# Altium schematic sheet MainBoard_Light.SchDoc: Main Board Light Detector
size A4; DrawnBy: M. Schwegler; Organization: HSLU T&A; Address1: Abteilung Elektrotechnik; Address2: Technikumsstrasse 21; Address3: CH-6048 Horw; Revision: v2; SheetNumber: 4; SheetTotal: 5; Projektname: SmartBoard; DocumentName: MainBoard; ProjectName: SmartBoard
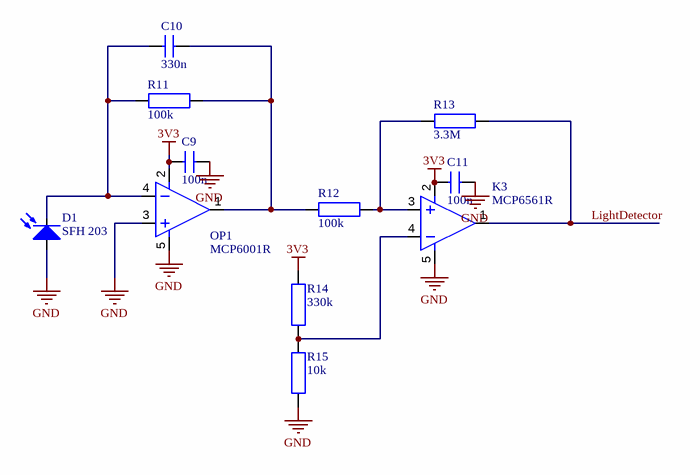
[diagram p0: MainBoard_Light.SchDoc]

## Parts
C9  100n  [0805_C]
C10  330n  [0805_C]
C11  100n  [0805_C]
D1  SFH 203  [LED_THT_5mm_RM_2.54mm]
K3  MCP6561R  [SOT23-5]
OP1  MCP6001R  [SOT23-5]
R11  100k  [0805_R]
R12  100k  [0805_R]
R13  3.3M  [0805_R]
R14  330k  [0805_R]
R15  10k  [0805_R]

## Nets
3V3: C9.1 C11.1 K3.2 OP1.2 R14.1
GND: C9.2 C11.2 D1.1(A) K3.5 OP1.3 OP1.5 R15.2
LightDetector: K3.1 R13.1
NetC10_1: C10.1 D1.2(K) OP1.4 R11.2
NetC10_2: C10.2 OP1.1 R11.1 R12.2
NetK3_3: K3.3 R12.1 R13.2
NetK3_4: K3.4 R14.2 R15.1

## Notes on the sheet
- Project:
- Drawn by:
- Size:
- Sheet
- A4
- Rev.:
- of
- Date:
- File:

## Library data of the parts
C9-C11 = C?: Normaler Kondensator
D1 = Photo_Diode_1A_2K
K3 OP1 = OPAMP
R11-R15 = R?: Normaler Widerstand